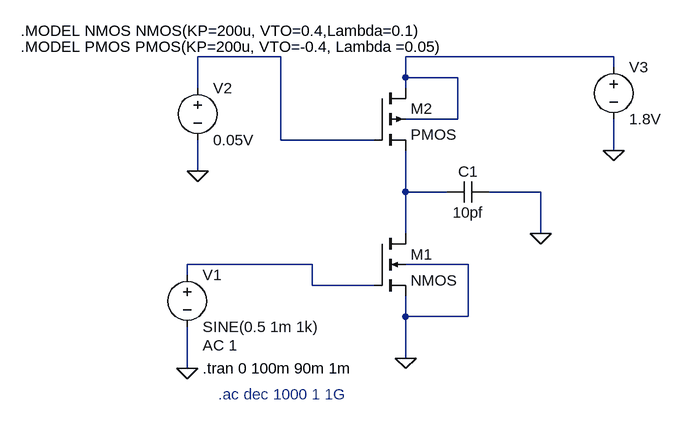
[diagram p0: schematic CS amplifier with Current Source.asc]
CS amplifier with Current Source.asc, the LTspice schematic file:
Version 4
SHEET 1 880 680
WIRE 0 -112 -128 -112
WIRE 512 -112 192 -112
WIRE 512 -96 512 -112
WIRE 192 -80 192 -112
WIRE 272 -80 192 -80
WIRE -128 -64 -128 -112
WIRE 192 -64 192 -80
WIRE 272 -16 272 -80
WIRE 272 -16 192 -16
WIRE 0 16 0 -112
WIRE 144 16 0 16
WIRE 512 32 512 -16
WIRE -128 64 -128 16
WIRE 192 96 192 32
WIRE 256 96 192 96
WIRE 400 96 320 96
WIRE 192 160 192 96
WIRE 400 160 400 96
WIRE 48 208 -144 208
WIRE 288 208 192 208
WIRE -144 224 -144 208
WIRE 48 240 48 208
WIRE 144 240 48 240
WIRE 192 288 192 256
WIRE 288 288 288 208
WIRE 288 288 192 288
WIRE 192 352 192 288
WIRE -144 368 -144 304
FLAG -144 368 0
FLAG -128 64 0
FLAG 512 32 0
FLAG 192 352 0
FLAG 400 160 0
SYMBOL nmos4 144 160 R0
SYMATTR InstName M1
SYMATTR Value2 l=0.18u w=3.6u
SYMBOL voltage -144 208 R0
WINDOW 123 24 124 Left 2
WINDOW 39 0 0 Left 0
SYMATTR Value2 AC 1
SYMATTR InstName V1
SYMATTR Value SINE(0.5 1m 1k)
SYMBOL voltage -128 -80 R0
SYMATTR InstName V2
SYMATTR Value 0.05V
SYMBOL voltage 512 -112 R0
SYMATTR InstName V3
SYMATTR Value 1.8V
SYMBOL pmos4 144 -64 R0
SYMATTR InstName M2
SYMATTR Value2 l=10u w=1u
SYMBOL cap 320 80 R90
WINDOW 0 0 32 VBottom 2
WINDOW 3 32 32 VTop 2
SYMATTR InstName C1
SYMATTR Value 10pf
TEXT -120 368 Left 2 !.tran 0 100m 90m 1m
TEXT -400 -152 Left 2 !.MODEL NMOS NMOS(KP=200u, VTO=0.4,Lambda=0.1)
TEXT -400 -128 Left 2 !.MODEL PMOS PMOS(KP=200u, VTO=-0.4, Lambda =0.05)
TEXT -96 408 Left 2 ;.ac dec 1000 1 1G

The netlist it stands for:
* CS amplifier with Current Source.asc
M1 N003 N004 0 0 NMOS l=0.18u w=3.6u
V1 N004 0 SINE(0.5 1m 1k) AC 1
V2 N001 0 0.05V
V3 N002 0 1.8V
M2 N002 N001 N003 N002 PMOS l=10u w=1u
C1 0 N003 10pf
.model NMOS NMOS
.model PMOS PMOS
.lib standard.mos
.tran 0 100m 90m 1m
.MODEL NMOS NMOS(KP=200u, VTO=0.4,Lambda=0.1)
.MODEL PMOS PMOS(KP=200u, VTO=-0.4, Lambda =0.05)
* .ac dec 1000 1 1G
.backanno
.end